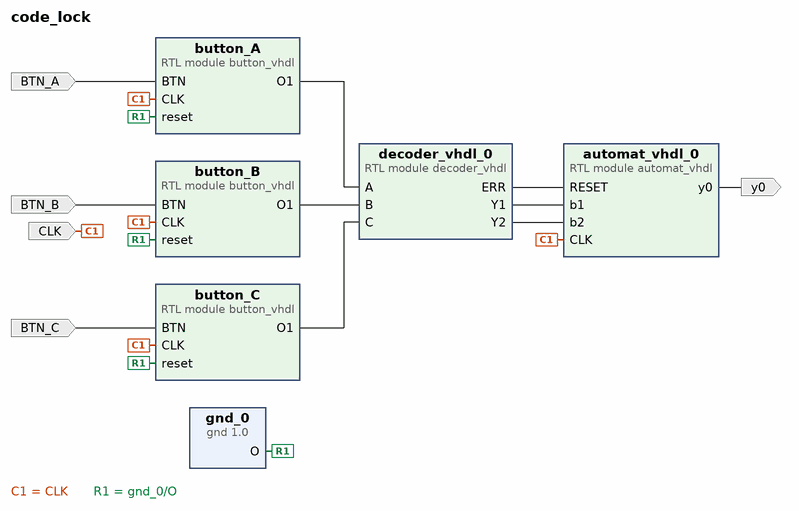
[diagram p0: block diagram of the top level]
# Vivado block design code_lock, xc7a35tcpg236-1, Vivado 2018.3
create_bd_design code_lock

create_bd_port -dir I CLK
create_bd_port -dir I BTN_B
create_bd_port -dir I BTN_C
create_bd_port -dir I BTN_A
create_bd_port -dir O y0

create_bd_cell -type module -reference button_vhdl button_A
create_bd_cell -type module -reference button_vhdl button_B
create_bd_cell -type module -reference button_vhdl button_C
create_bd_cell -type module -reference decoder_vhdl decoder_vhdl_0
create_bd_cell -type module -reference automat_vhdl automat_vhdl_0
create_bd_cell -type ip -vlnv FIT:user:gnd:1.0 gnd_0

# ---- connections ----

connect_bd_net [get_bd_pins button_A/O1] [get_bd_pins decoder_vhdl_0/A]
connect_bd_net [get_bd_pins button_B/O1] [get_bd_pins decoder_vhdl_0/B]
connect_bd_net [get_bd_pins button_C/O1] [get_bd_pins decoder_vhdl_0/C]
connect_bd_net [get_bd_pins decoder_vhdl_0/ERR] [get_bd_pins automat_vhdl_0/RESET]
connect_bd_net [get_bd_pins decoder_vhdl_0/Y1] [get_bd_pins automat_vhdl_0/b1]
connect_bd_net [get_bd_pins decoder_vhdl_0/Y2] [get_bd_pins automat_vhdl_0/b2]
connect_bd_net [get_bd_ports CLK] [get_bd_pins button_A/CLK] [get_bd_pins button_B/CLK] [get_bd_pins button_C/CLK] [get_bd_pins automat_vhdl_0/CLK]
connect_bd_net -net BTN_0_1 [get_bd_ports BTN_B] [get_bd_pins button_B/BTN]
connect_bd_net -net BTN_1_1 [get_bd_ports BTN_C] [get_bd_pins button_C/BTN]
connect_bd_net -net BTN_2_1 [get_bd_ports BTN_A] [get_bd_pins button_A/BTN]
connect_bd_net [get_bd_pins automat_vhdl_0/y0] [get_bd_ports y0]
connect_bd_net [get_bd_pins gnd_0/O] [get_bd_pins button_A/reset] [get_bd_pins button_B/reset] [get_bd_pins button_C/reset]

validate_bd_design
save_bd_design
